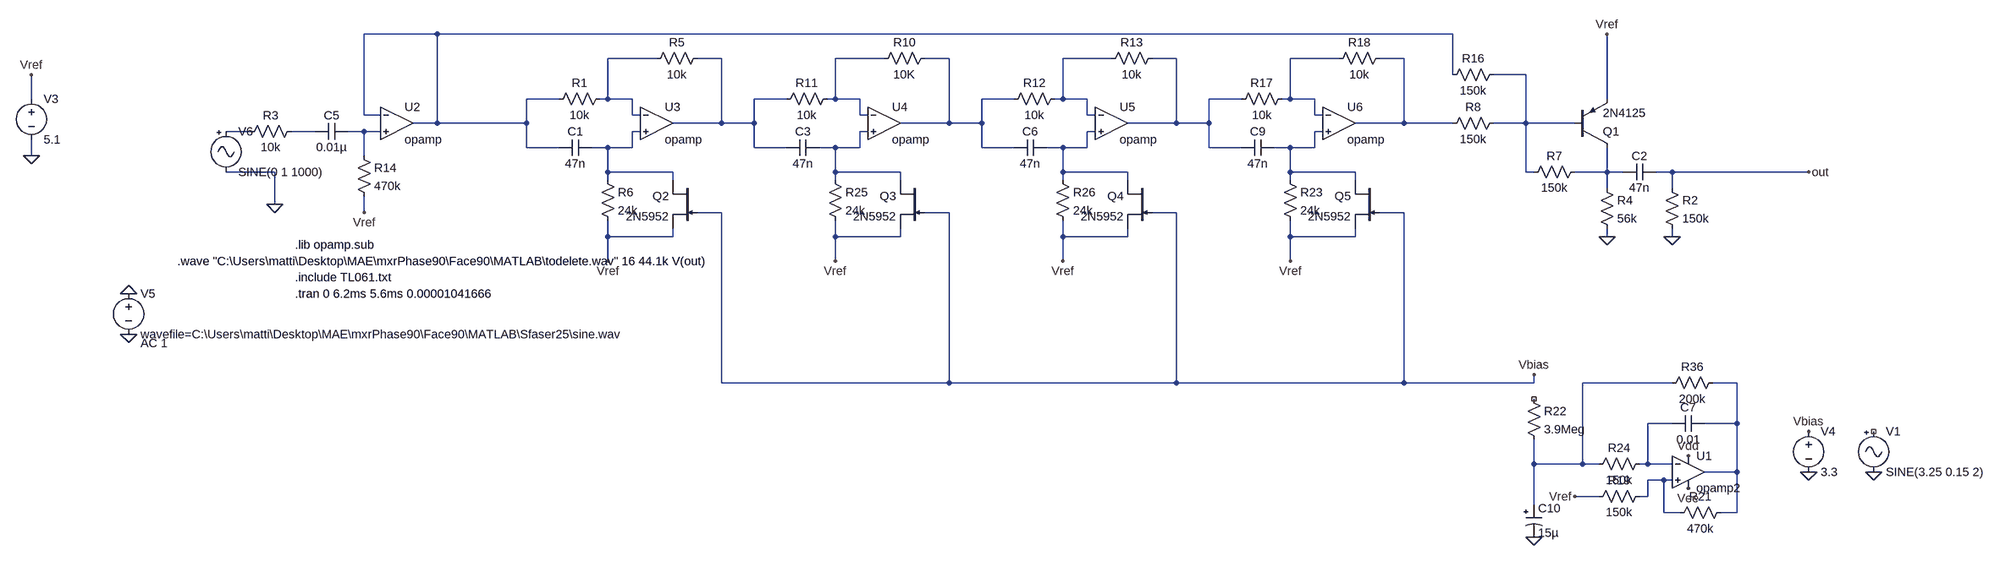
[diagram p0: schematic phase90 ideal.asc]
phase90 ideal.asc, the LTspice schematic file:
Version 4
SHEET 1 3756 1140
WIRE 720 48 576 48
WIRE 2720 48 720 48
WIRE 1152 96 1056 96
WIRE 1280 96 1232 96
WIRE 1600 96 1504 96
WIRE 1728 96 1680 96
WIRE 2048 96 1952 96
WIRE 2176 96 2128 96
WIRE 2496 96 2400 96
WIRE 2624 96 2576 96
WIRE 2720 128 2720 48
WIRE 2864 128 2800 128
WIRE -176 176 -176 128
WIRE 960 176 896 176
WIRE 1056 176 1056 96
WIRE 1056 176 1040 176
WIRE 1104 176 1056 176
WIRE 1408 176 1344 176
WIRE 1504 176 1504 96
WIRE 1504 176 1488 176
WIRE 1552 176 1504 176
WIRE 1856 176 1792 176
WIRE 1952 176 1952 96
WIRE 1952 176 1936 176
WIRE 2000 176 1952 176
WIRE 2304 176 2240 176
WIRE 2400 176 2400 96
WIRE 2400 176 2384 176
WIRE 2448 176 2400 176
WIRE 3024 176 3024 48
WIRE 576 208 576 48
WIRE 608 208 576 208
WIRE 1104 208 1104 176
WIRE 1120 208 1104 208
WIRE 1552 208 1552 176
WIRE 1568 208 1552 208
WIRE 2000 208 2000 176
WIRE 2016 208 2000 208
WIRE 2448 208 2448 176
WIRE 2464 208 2448 208
WIRE 720 224 720 48
WIRE 720 224 672 224
WIRE 896 224 896 176
WIRE 896 224 720 224
WIRE 1280 224 1280 96
WIRE 1280 224 1184 224
WIRE 1344 224 1344 176
WIRE 1344 224 1280 224
WIRE 1728 224 1728 96
WIRE 1728 224 1632 224
WIRE 1792 224 1792 176
WIRE 1792 224 1728 224
WIRE 2176 224 2176 96
WIRE 2176 224 2080 224
WIRE 2240 224 2240 176
WIRE 2240 224 2176 224
WIRE 2624 224 2624 96
WIRE 2624 224 2528 224
WIRE 2720 224 2624 224
WIRE 2864 224 2864 128
WIRE 2864 224 2800 224
WIRE 2960 224 2864 224
WIRE 352 240 304 240
WIRE 480 240 432 240
WIRE 576 240 544 240
WIRE 608 240 576 240
WIRE 1120 240 1104 240
WIRE 1568 240 1552 240
WIRE 2016 240 2000 240
WIRE 2464 240 2448 240
WIRE 896 272 896 224
WIRE 960 272 896 272
WIRE 1056 272 1024 272
WIRE 1104 272 1104 240
WIRE 1104 272 1056 272
WIRE 1344 272 1344 224
WIRE 1408 272 1344 272
WIRE 1504 272 1472 272
WIRE 1552 272 1552 240
WIRE 1552 272 1504 272
WIRE 1792 272 1792 224
WIRE 1856 272 1792 272
WIRE 1952 272 1920 272
WIRE 2000 272 2000 240
WIRE 2000 272 1952 272
WIRE 2240 272 2240 224
WIRE 2304 272 2240 272
WIRE 2400 272 2368 272
WIRE 2448 272 2448 240
WIRE 2448 272 2400 272
WIRE -176 288 -176 256
WIRE 576 288 576 240
WIRE 400 320 304 320
WIRE 1056 320 1056 272
WIRE 1184 320 1056 320
WIRE 1504 320 1504 272
WIRE 1632 320 1504 320
WIRE 1952 320 1952 272
WIRE 2080 320 1952 320
WIRE 2400 320 2400 272
WIRE 2528 320 2400 320
WIRE 2864 320 2864 224
WIRE 2880 320 2864 320
WIRE 3024 320 3024 272
WIRE 3024 320 2960 320
WIRE 3056 320 3024 320
WIRE 3152 320 3120 320
WIRE 3456 320 3152 320
WIRE 1056 336 1056 320
WIRE 1184 336 1184 320
WIRE 1504 336 1504 320
WIRE 1632 336 1632 320
WIRE 1952 336 1952 320
WIRE 2080 336 2080 320
WIRE 2400 336 2400 320
WIRE 2528 336 2528 320
WIRE 3024 352 3024 320
WIRE 3152 352 3152 320
WIRE 400 384 400 320
WIRE 576 400 576 368
WIRE 1280 400 1232 400
WIRE 1728 400 1680 400
WIRE 2176 400 2128 400
WIRE 2624 400 2576 400
WIRE 1056 448 1056 416
WIRE 1184 448 1184 432
WIRE 1184 448 1056 448
WIRE 1504 448 1504 416
WIRE 1632 448 1632 432
WIRE 1632 448 1504 448
WIRE 1952 448 1952 416
WIRE 2080 448 2080 432
WIRE 2080 448 1952 448
WIRE 2400 448 2400 416
WIRE 2528 448 2528 432
WIRE 2528 448 2400 448
WIRE 3024 448 3024 432
WIRE 3152 448 3152 432
WIRE 1056 496 1056 448
WIRE 1504 496 1504 448
WIRE 1952 496 1952 448
WIRE 2400 496 2400 448
WIRE 1280 736 1280 400
WIRE 1728 736 1728 400
WIRE 1728 736 1280 736
WIRE 2176 736 2176 400
WIRE 2176 736 1728 736
WIRE 2624 736 2624 400
WIRE 2624 736 2176 736
WIRE 2880 736 2880 720
WIRE 2880 736 2624 736
WIRE 3152 736 2976 736
WIRE 3280 736 3232 736
WIRE 3152 816 3104 816
WIRE 3280 816 3280 736
WIRE 3280 816 3216 816
WIRE 2880 896 2880 848
WIRE 2976 896 2976 736
WIRE 2976 896 2880 896
WIRE 3008 896 2976 896
WIRE 3104 896 3104 816
WIRE 3104 896 3088 896
WIRE 3152 896 3104 896
WIRE 3280 912 3280 816
WIRE 3280 912 3216 912
WIRE 3136 928 3104 928
WIRE 3152 928 3136 928
WIRE 3008 960 2960 960
WIRE 3104 960 3104 928
WIRE 3104 960 3088 960
WIRE 2880 976 2880 896
WIRE 3136 992 3136 928
WIRE 3168 992 3136 992
WIRE 3280 992 3280 912
WIRE 3280 992 3248 992
FLAG -176 288 0
FLAG -176 128 Vref
FLAG 576 400 Vref
FLAG 400 384 0
FLAG 1056 496 Vref
FLAG 1504 496 Vref
FLAG 1952 496 Vref
FLAG 2400 496 Vref
FLAG 3024 48 Vref
FLAG 3024 448 0
FLAG 3152 448 0
FLAG 2960 960 Vref
FLAG 2880 1040 0
FLAG 2880 720 Vbias
FLAG 3456 320 out
FLAG 3184 880 Vdd
FLAG 3184 944 Vee
FLAG 3456 912 0
FLAG 3456 832 Vbias
FLAG 112 640 0
FLAG 112 560 0
FLAG 3584 912 0
SYMBOL cap 544 224 R90
WINDOW 0 0 32 VBottom 2
WINDOW 3 32 32 VTop 2
SYMATTR InstName C5
SYMATTR Value 0.01µ
SYMBOL res 448 224 R90
WINDOW 0 0 56 VBottom 2
WINDOW 3 32 56 VTop 2
SYMATTR InstName R3
SYMATTR Value 10k
SYMBOL res 560 272 R0
SYMATTR InstName R14
SYMATTR Value 470k
SYMBOL voltage -176 160 R0
SYMATTR InstName V3
SYMATTR Value 5.1
SYMBOL cap 1024 256 R90
WINDOW 0 0 32 VBottom 2
WINDOW 3 32 32 VTop 2
SYMATTR InstName C1
SYMATTR Value 47n
SYMBOL res 1056 160 R90
WINDOW 0 0 56 VBottom 2
WINDOW 3 32 56 VTop 2
SYMATTR InstName R1
SYMATTR Value 10k
SYMBOL res 1040 320 R0
SYMATTR InstName R6
SYMATTR Value 24k
SYMBOL njf 1232 336 M0
SYMATTR InstName Q2
SYMATTR Value 2N5952
SYMBOL res 1248 80 R90
WINDOW 0 0 56 VBottom 2
WINDOW 3 32 56 VTop 2
SYMATTR InstName R5
SYMATTR Value 10k
SYMBOL cap 1472 256 R90
WINDOW 0 0 32 VBottom 2
WINDOW 3 32 32 VTop 2
SYMATTR InstName C3
SYMATTR Value 47n
SYMBOL res 1504 160 R90
WINDOW 0 0 56 VBottom 2
WINDOW 3 32 56 VTop 2
SYMATTR InstName R11
SYMATTR Value 10k
SYMBOL res 1488 320 R0
SYMATTR InstName R25
SYMATTR Value 24k
SYMBOL njf 1680 336 M0
SYMATTR InstName Q3
SYMATTR Value 2N5952
SYMBOL res 1696 80 R90
WINDOW 0 0 56 VBottom 2
WINDOW 3 32 56 VTop 2
SYMATTR InstName R10
SYMATTR Value 10K
SYMBOL cap 1920 256 R90
WINDOW 0 0 32 VBottom 2
WINDOW 3 32 32 VTop 2
SYMATTR InstName C6
SYMATTR Value 47n
SYMBOL res 1952 160 R90
WINDOW 0 0 56 VBottom 2
WINDOW 3 32 56 VTop 2
SYMATTR InstName R12
SYMATTR Value 10k
SYMBOL res 1936 320 R0
SYMATTR InstName R26
SYMATTR Value 24k
SYMBOL njf 2128 336 M0
SYMATTR InstName Q4
SYMATTR Value 2N5952
SYMBOL res 2144 80 R90
WINDOW 0 0 56 VBottom 2
WINDOW 3 32 56 VTop 2
SYMATTR InstName R13
SYMATTR Value 10k
SYMBOL cap 2368 256 R90
WINDOW 0 0 32 VBottom 2
WINDOW 3 32 32 VTop 2
SYMATTR InstName C9
SYMATTR Value 47n
SYMBOL res 2400 160 R90
WINDOW 0 0 56 VBottom 2
WINDOW 3 32 56 VTop 2
SYMATTR InstName R17
SYMATTR Value 10k
SYMBOL res 2384 320 R0
SYMATTR InstName R23
SYMATTR Value 24k
SYMBOL njf 2576 336 M0
SYMATTR InstName Q5
SYMATTR Value 2N5952
SYMBOL res 2592 80 R90
WINDOW 0 0 56 VBottom 2
WINDOW 3 32 56 VTop 2
SYMATTR InstName R18
SYMATTR Value 10k
SYMBOL res 2816 208 R90
WINDOW 0 0 56 VBottom 2
WINDOW 3 32 56 VTop 2
SYMATTR InstName R8
SYMATTR Value 150k
SYMBOL res 2816 112 R90
WINDOW 0 0 56 VBottom 2
WINDOW 3 32 56 VTop 2
SYMATTR InstName R16
SYMATTR Value 150k
SYMBOL res 2976 304 R90
WINDOW 0 0 56 VBottom 2
WINDOW 3 32 56 VTop 2
SYMATTR InstName R7
SYMATTR Value 150k
SYMBOL pnp 2960 272 M180
SYMATTR InstName Q1
SYMATTR Value 2N4125
SYMBOL cap 3120 304 R90
WINDOW 0 0 32 VBottom 2
WINDOW 3 32 32 VTop 2
SYMATTR InstName C2
SYMATTR Value 47n
SYMBOL res 3008 336 R0
SYMATTR InstName R4
SYMATTR Value 56k
SYMBOL res 3136 336 R0
SYMATTR InstName R2
SYMATTR Value 150k
SYMBOL OpAmps\\opamp2 3184 848 R0
SYMATTR InstName U1
SYMBOL cap 3216 800 R90
WINDOW 0 0 32 VBottom 2
WINDOW 3 32 32 VTop 2
SYMATTR InstName C7
SYMATTR Value 0.01
SYMBOL res 3264 976 R90
WINDOW 0 0 56 VBottom 2
WINDOW 3 32 56 VTop 2
SYMATTR InstName R21
SYMATTR Value 470k
SYMBOL res 3104 880 R90
WINDOW 0 0 56 VBottom 2
WINDOW 3 32 56 VTop 2
SYMATTR InstName R24
SYMATTR Value 150k
SYMBOL res 3104 944 R90
WINDOW 0 0 56 VBottom 2
WINDOW 3 32 56 VTop 2
SYMATTR InstName R19
SYMATTR Value 150k
SYMBOL res 2864 752 R0
SYMATTR InstName R22
SYMATTR Value 3.9Meg
SYMBOL polcap 2864 976 R0
SYMATTR InstName C10
SYMATTR Value 15µ
SYMBOL res 3248 720 R90
WINDOW 0 0 56 VBottom 2
WINDOW 3 32 56 VTop 2
SYMATTR InstName R36
SYMATTR Value 200k
SYMBOL voltage 112 544 R0
WINDOW 123 24 114 Left 2
WINDOW 39 0 0 Left 0
SYMATTR Value2 AC 1
SYMATTR InstName V5
SYMATTR Value wavefile=C:\Users\matti\Desktop\MAE\mxrPhase90\Face90\MATLAB\Sfaser25\sine.wav
SYMBOL voltage 3456 816 R0
WINDOW 123 0 0 Left 0
WINDOW 39 0 0 Left 0
SYMATTR InstName V4
SYMATTR Value 3.3
SYMBOL Misc\\signal 304 224 R0
WINDOW 123 0 0 Left 0
WINDOW 39 0 0 Left 0
SYMATTR InstName V6
SYMATTR Value SINE(0 1 1000)
SYMBOL OpAmps\\opamp 640 160 R0
SYMATTR InstName U2
SYMBOL OpAmps\\opamp 1152 160 R0
SYMATTR InstName U3
SYMBOL OpAmps\\opamp 1600 160 R0
SYMATTR InstName U4
SYMBOL OpAmps\\opamp 2048 160 R0
SYMATTR InstName U5
SYMBOL OpAmps\\opamp 2496 160 R0
SYMATTR InstName U6
SYMBOL Misc\\signal 3584 816 R0
WINDOW 123 0 0 Left 0
WINDOW 39 0 0 Left 0
SYMATTR InstName V1
SYMATTR Value SINE(3.25 0.15 2)
TEXT 440 528 Left 2 !.include TL061.txt
TEXT 440 560 Left 2 !.tran 0 6.2ms 5.6ms 0.00001041666
TEXT 208 496 Left 2 !.wave "C:\\Users\\matti\\Desktop\\MAE\\mxrPhase90\\Face90\\MATLAB\\todelete.wav" 16 44.1k V(out)
TEXT 440 464 Left 2 !.lib opamp.sub

The netlist it stands for:
* phase90 ideal.asc
C5 N013 N012 0.01µ
R3 N012 N011 10k
R14 N013 Vref 470k
V3 Vref 0 5.1
C1 N014 N001 47n
R1 N002 N001 10k
R6 N014 Vref 24k
J§Q2 N014 Vbias Vref 2N5952
R5 N003 N002 10k
C3 N015 N003 47n
R11 N004 N003 10k
R25 N015 Vref 24k
J§Q3 N015 Vbias Vref 2N5952
R10 N005 N004 10K
C6 N016 N005 47n
R12 N006 N005 10k
R26 N016 Vref 24k
J§Q4 N016 Vbias Vref 2N5952
R13 N007 N006 10k
C9 N017 N007 47n
R17 N008 N007 10k
R23 N017 Vref 24k
J§Q5 N017 Vbias Vref 2N5952
R18 N009 N008 10k
R8 N010 N009 150k
R16 N010 N001 150k
R7 N018 N010 150k
Q1 N018 N010 Vref 0 2N4125
C2 out N018 47n
R4 N018 0 56k
R2 out 0 150k
XU1 N022 N021 Vdd Vee N020 opamp2  ; pins In+ In- V+ V- OUT
C7 N020 N021 0.01
R21 N020 N022 470k
R24 N021 N019 150k
R19 N022 Vref 150k
R22 NC_01 N019 3.9Meg
C10 N019 0 15µ
R36 N020 N019 200k
V5 0 0 wavefile=C:\Users\matti\Desktop\MAE\mxrPhase90\Face90\MATLAB\Sfaser25\sine.wav AC 1
V4 Vbias 0 3.3
V6 N011 0 SINE(0 1 1000)
XU2 N001 N013 N001 opamp Aol=100K GBW=10Meg  ; pins invin noninvin out
XU3 N002 N014 N003 opamp Aol=100K GBW=10Meg  ; pins invin noninvin out
XU4 N004 N015 N005 opamp Aol=100K GBW=10Meg  ; pins invin noninvin out
XU5 N006 N016 N007 opamp Aol=100K GBW=10Meg  ; pins invin noninvin out
XU6 N008 N017 N009 opamp Aol=100K GBW=10Meg  ; pins invin noninvin out
V1 NC_02 0 SINE(3.25 0.15 2)
.model NPN NPN
.model PNP PNP
.lib standard.bjt
.model NJF NJF
.model PJF PJF
.lib standard.jft
.include TL061.txt
.tran 0 6.2ms 5.6ms 0.00001041666
.wave "C:\Users\matti\Desktop\MAE\mxrPhase90\Face90\MATLAB\todelete.wav" 16 44.1k V(out)
.lib opamp.sub
.backanno
.end